# Altium schematic sheet MCISO-S08-V00-HallDifferentials.SchDoc
size A4; SheetNumber: 5; SheetTotal: 9
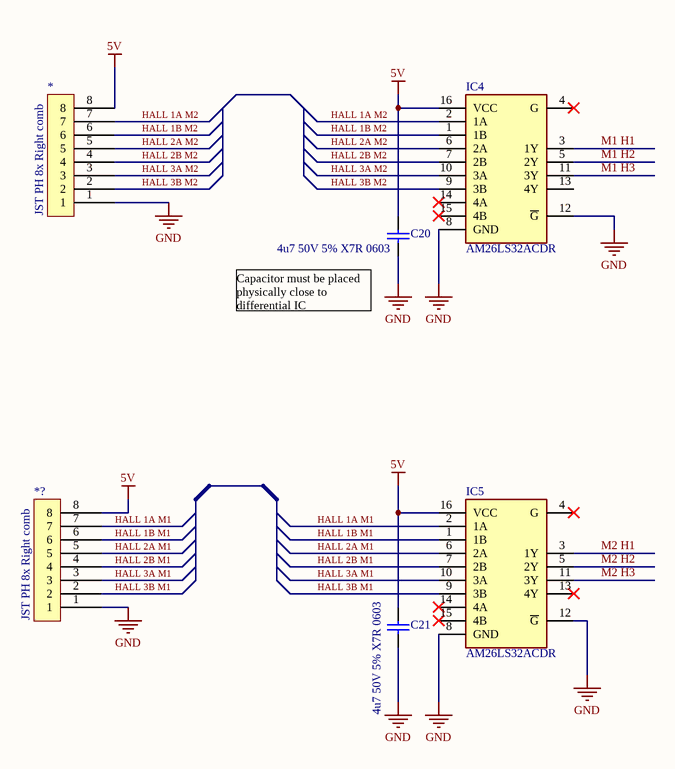
[diagram p0: MCISO-S08-V00-HallDifferentials.SchDoc]

## Parts
*  JST PH 8x Right comb  [JST PH 8x RIGHT SMD]
*?  JST PH 8x Right comb  [JST PH 8x RIGHT SMD]
C20  4u7 50V 5% X7R 0603  [Cap_Ceramic_0603]
C21  4u7 50V 5% X7R 0603  [Cap_Ceramic_0603]
IC4  AM26LS32ACDR  [SOIC127P600X175-16N]
IC5  AM26LS32ACDR  [SOIC127P600X175-16N]

## Nets
5V: *.8 *?.8 C20.2 C21.2 IC4.16(VCC) IC5.16(VCC)
GND: *.1 *?.1 C20.1 C21.1 IC4.8(GND) IC4.12(~{G}) IC5.8(GND) IC5.12(~{G})
HALL 1A M1: *?.7 IC5.2(1A)
HALL 1A M2: *.7 IC4.2(1A)
HALL 1B M1: *?.6 IC5.1(1B)
HALL 1B M2: *.6 IC4.1(1B)
HALL 2A M1: *?.5 IC5.6(2A)
HALL 2A M2: *.5 IC4.6(2A)
HALL 2B M1: *?.4 IC5.7(2B)
HALL 2B M2: *.4 IC4.7(2B)
HALL 3A M1: *?.3 IC5.10(3A)
HALL 3A M2: *.3 IC4.10(3A)
HALL 3B M1: *?.2 IC5.9(3B)
HALL 3B M2: *.2 IC4.9(3B)
M1 H1: IC4.3(1Y)
M1 H2: IC4.5(2Y)
M1 H3: IC4.11(3Y)
M2 H1: IC5.3(1Y)
M2 H2: IC5.5(2Y)
M2 H3: IC5.11(3Y)

Not connected (* = marked no-connect by the designer): IC4 4(G)* 13(4Y) 14(4A)* 15(4B)*; IC5 4(G)* 13(4Y)* 14(4A)* 15(4B)*

## Notes on the sheet
- (near C20) Capacitor must be placed physically close to differential IC

## Library data of the parts
C20 C21 = 4u7 50V 5% X7R 0603: Capacitor, Ceramic, SMD, 4u7, 50V, 5%, X7R, 0603
IC4 IC5 = AM26LS32ACDR: Integrated Circuit; Manufacturer_Name: Texas Instruments; Datasheet Link: http://www.ti.com/lit/gpn/am26ls32ac; Height: 1.75mm; Manufacturer_Part_Number: AM26LS32ACDR; Mouser Part Number: 595-AM26LS32ACDR; Mouser Price/Stock: https://www.mouser.co.uk/ProductDetail/Texas-Instruments/AM26LS32ACDR/?qs=L4Mc90zKIpjEhSPPcfdoEw%3D%3D; Arrow Part Number: AM26LS32ACDR; Arrow Price/Stock: https://www.arrow.com/en/products/am26ls32acdr/texas-instruments